# EAGLE design Balloon2 (EAGLE 7.3.0)
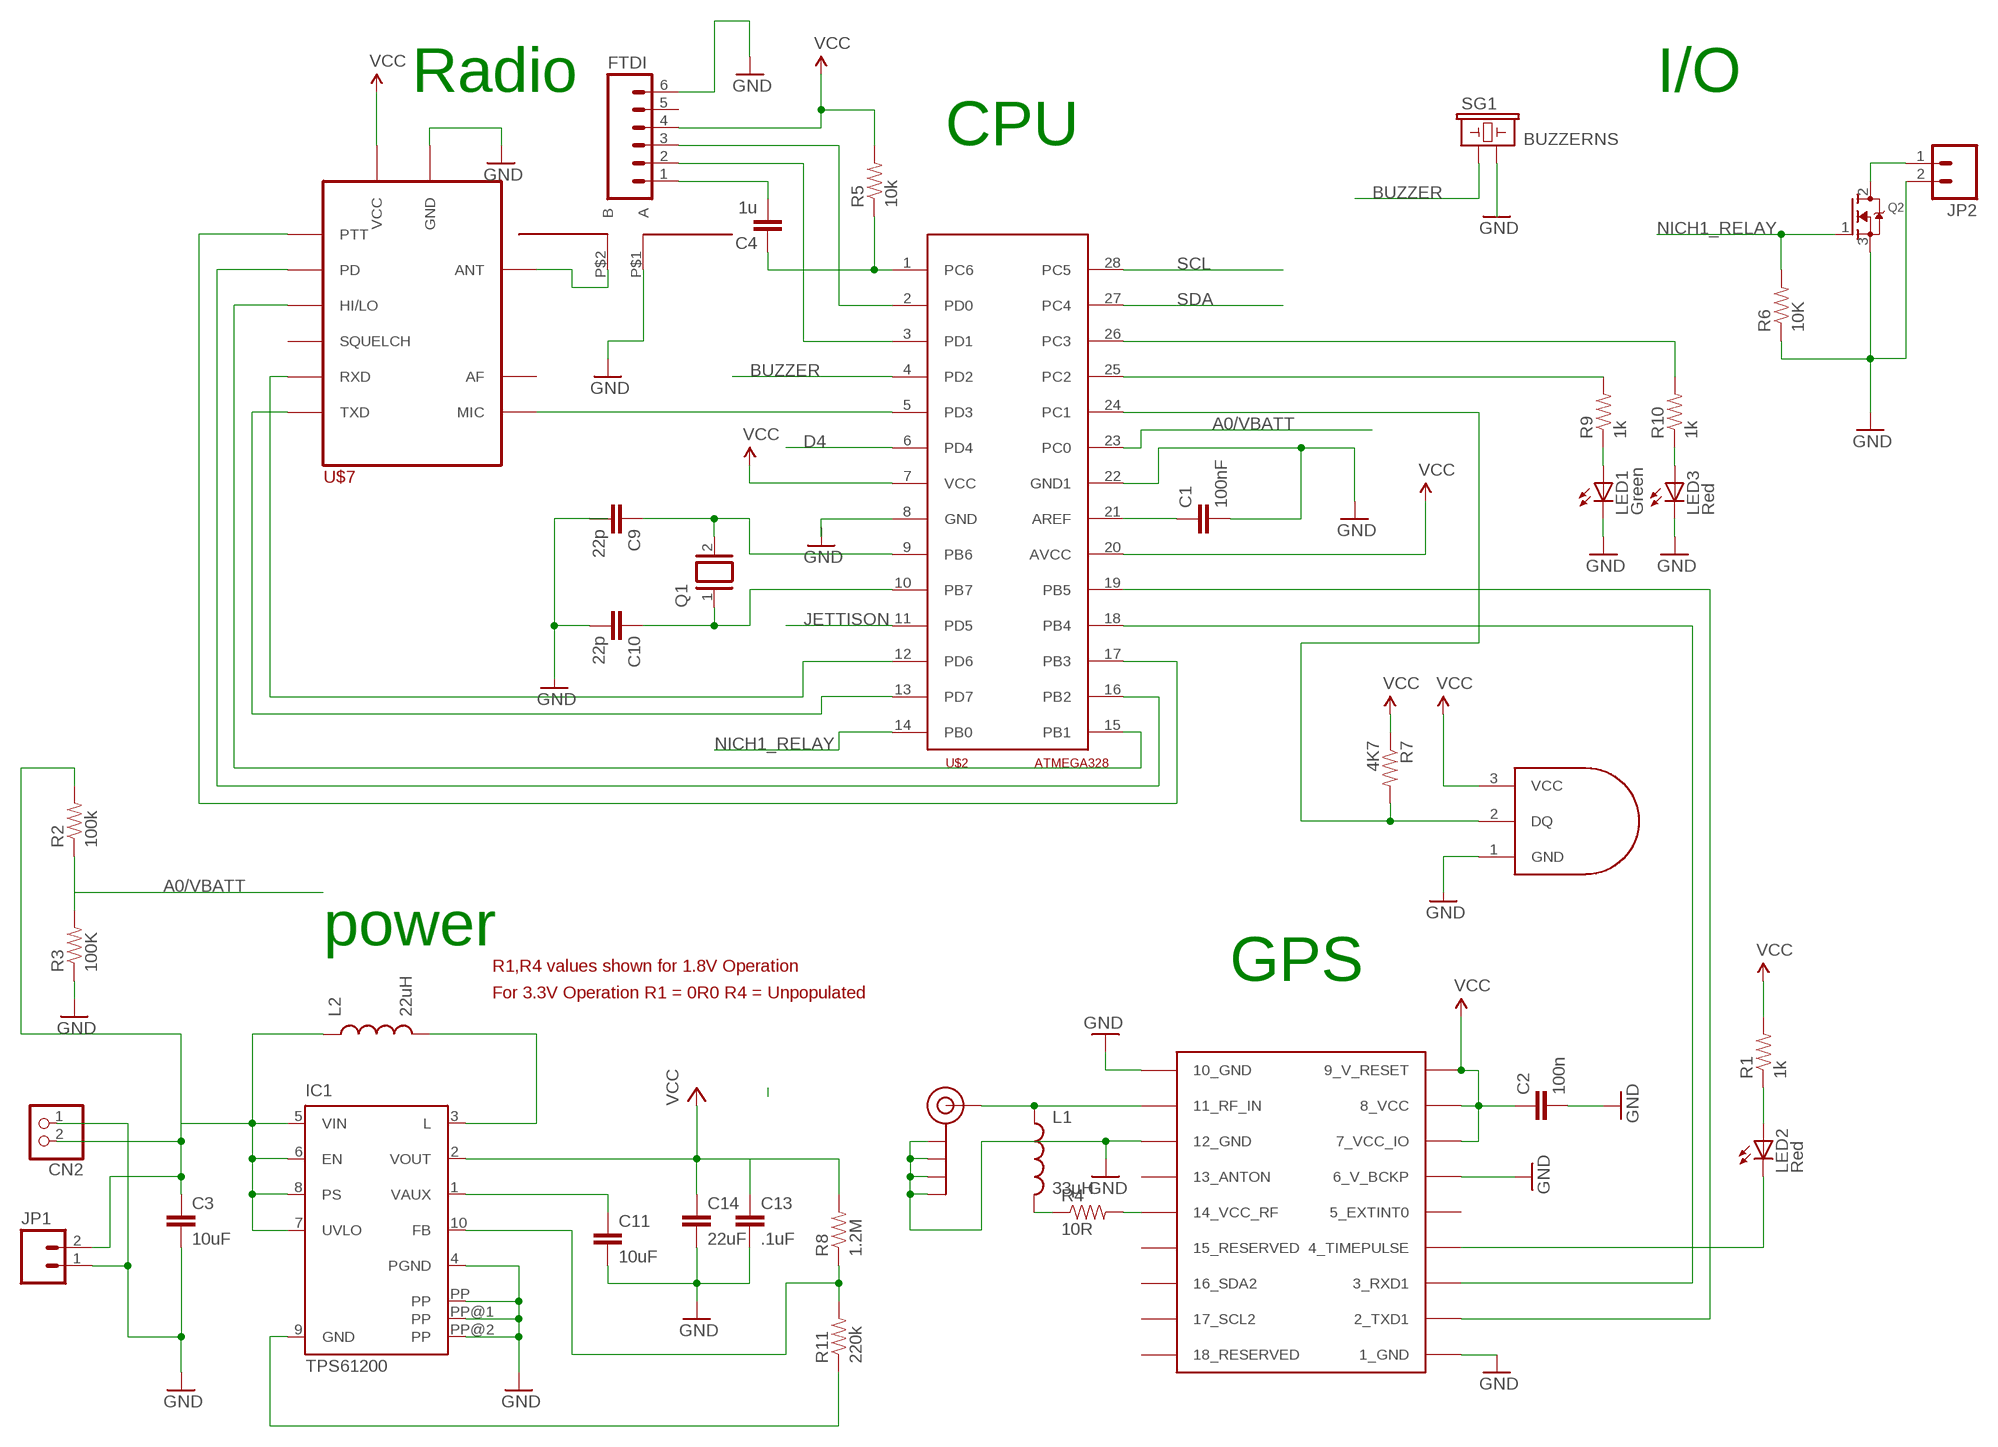
[diagram p0: schematic, sheet 1]

## Parts
C1  100nF  CAP0805  [0805]
C2  100n  CAP0805  [0805]
C3  10uF  CAP0805  [0805]
C4  1u  CAP0805  [0805]
C9  22p  CAP0805  [0805]
C10  22p  CAP0805  [0805]
C11  10uF  CAP0805  [0805]
C13  .1uF  CAP0805  [0805]
C14  22uF  CAP0805  [0805]
CN2  JST_2PIN-SMT-RA  [JST-PH-2-SMT-RA]
FTDI  M06SIP  [1X06]
IC1  TPS61200  [S-PDSO-N10]
J$2  SMA_EDGE  [SMA-EDGE]
JP1  M02PTH  [1X02]
JP2  M02PTH  [1X02]
L1  33µH  INDUCTOR0805  [0805]
L2  22uH  INDUCTOR  [INDUCTOR-SRP4020]
LED1  Green  LEDCHIP-LED0805  [CHIP-LED0805]
LED2  Red  LEDCHIP-LED0805  [CHIP-LED0805]
LED3  Red  LEDCHIP-LED0805  [CHIP-LED0805]
Q1  XTAL/S  [QS]
Q2  MOSFET-NGDS_TO220V  [TO220V]
R1  1k  RESISTOR0805-RES  [0805]
R2  100k  RESISTOR0805-RES  [0805]
R3  100K  RESISTOR0805-RES  [0805]
R4  10R  RESISTOR0805-RES  [0805]
R5  10k  RESISTOR0805-RES  [0805]
R6  10K  RESISTOR0805-RES  [0805]
R7  4K7  RESISTOR0805-RES  [0805]
R8  1.2M  RESISTOR0805-RES  [0805]
R9  1k  RESISTOR0805-RES  [0805]
R10  1k  RESISTOR0805-RES  [0805]
R11  220k  RESISTOR0805-RES  [0805]
SG1  BUZZERNS  [BUZZER-12MM-NS]
U$1  UBLOX_MAX  [UBLOX_MAX]
U$2  ATMEGA328  [DIL28]
U$3  DS18B20  [TO-92]
U$4  SOLDER-DIPOLE  [SOLDERED-DIPOLE-5MM]
U$7  DORJI  [DORJI]

## Nets
A0/VBATT [vcc]: R2.1 R3.2 U$2.23(PC0)
BUZZER: SG1.+ U$2.4(PD2)
D4: U$2.6(PD4)
GND [vcc]: C1.2 C2.2 C3.2 C11.2 C13.2 C14.2 CN2.1 FTDI.6 IC1.4(PGND) IC1.PP IC1.PP@1(PP) IC1.PP@2(PP) J$2.GND@0(GND) J$2.GND@1(GND) J$2.GND@2(GND) J$2.GND@3(GND) JP1.1 JP2.2 LED1.C LED3.C Q2.3(S) R3.1 R6.1 U$1.1_GND U$1.6_V_BCKP U$1.10_GND U$1.12_GND U$2.22(GND1) U$4.P$1(A) U$7.P$9(GND) U$7.P$10(GND)
JETTISON: U$2.11(PD5)
N$1: U$2.5(PD3) U$7.P$18(MIC)
N$2: C4.2 FTDI.1
N$3: C4.1 R5.1 U$2.1(PC6)
N$4: J$2.SIG(SIGNAL) L1.1 U$1.11_RF_IN
N$5: IC1.3(L) L2.P$2
N$6: U$4.P$2(B) U$7.P$12(ANT)
N$8: LED2.A R1.1
N$9: FTDI.3 U$2.2(PD0)
N$10: FTDI.2 U$2.3(PD1)
N$11: LED2.C U$1.4_TIMEPULSE
N$12: LED1.A R9.1
N$13: LED3.A R10.1
N$14: L1.2 R4.1
N$15: R4.2 U$1.14_VCC_RF
N$16: U$2.8(GND)
N$17: C9.1 Q1.2 U$2.9(PB6)
N$18: C10.1 Q1.1 U$2.10(PB7)
N$19: C10.2
N$20: U$1.3_RXD1 U$2.18(PB4)
N$21: U$2.12(PD6) U$7.P$16(RXD)
N$22: U$2.13(PD7) U$7.P$17(TXD)
N$23: U$2.15(PB1) U$7.P$7(HI/LO)
N$24: U$2.16(PB2) U$7.P$6(PD)
N$25: U$2.17(PB3) U$7.P$5(PTT)
N$26: C3.1 CN2.2 IC1.5(VIN) IC1.6(EN) IC1.7(UVLO) IC1.8(PS) JP1.2 L2.P$1 R2.2
N$27: U$3.1(GND)
N$28: C1.1 U$2.21(AREF)
N$29: U$1.2_TXD1 U$2.19(PB5)
N$30: R10.2 U$2.26(PC3)
N$31: R9.2 U$2.25(PC2)
N$32: R7.2 U$2.24(PC1) U$3.2(DQ)
N$33: SG1.-
N$34: JP2.1 Q2.2(D)
N$35: IC1.10(FB) R8.1 R11.2
N$36: C11.1 IC1.1(VAUX)
N$37: IC1.9(GND) R11.1
NICH1_RELAY: Q2.1(G) R6.2 U$2.14(PB0)
SCL: U$2.28(PC5)
SDA: U$2.27(PC4)
VCC: C2.1 C13.1 C14.1 FTDI.4 IC1.2(VOUT) R1.2 R5.2 R7.1 R8.2 U$1.7_VCC_IO U$1.8_VCC U$1.9_V_RESET U$2.7(VCC) U$2.20(AVCC) U$3.3(VCC) U$7.P$8(VCC)
Unconnected: C9.2 FTDI.5 U$1.5_EXTINT0 U$1.13_ANTON U$1.15_RESERVED U$1.16_SDA2 U$1.17_SCL2 U$1.18_RESERVED U$7.P$1(SQUELCH) U$7.P$3(AF)

## Notes on the sheet
- Radio | I/O
- CPU
- power
- R1,R4 values shown for 1.8V Operation
- GPS
- For 3.3V Operation R1 = 0R0 R4 = Unpopulated

## Library data of the parts
C1-C4 C9-C11 C13 C14 = SparkFun-Capacitors:CAP: Capacitor Standard 0603 ceramic capacitor, and 0.1" leaded capacitor.
CN2 = adafruit:JST_2PIN: JST 2-Pin Connectors of various flavors SMT-RA (S2B-PH-SM4) 4UConnector #17311 SMT (B2B-PH-SM4) THM-RA (S2B-PH) THM (B2B-PH)
FTDI = SparkFun:M06: Header 6 Standard 6-pin 0.1" header. Use with straight break away headers (SKU : PRT-00116), right angle break away headers (PRT-00553), swiss pins (PRT-00743), machine pins (PRT-00117), and female headers (PRT-00115). Molex polarized connector foot print use with SKU : PRT-08094 with associated crimp pins and housings. NOTES ON THE VARIANTS LOCK and LOCK_LONGPADS... This footprint was designed to help hold the alignment of a through-hole component (i.e. 6-pin header) while soldering it into place. You may notice that each hole has been shifted either up or down by 0.005 of an inch from it's more standard position (which is a perfectly straight line). This slight alteration caused the pins (the squares in the middle) to touch the edges of the holes. Because they are alternating, it causes a "brace" to hold the component in place. 0.005 has proven to be the perfect amount of "off-center" position when using our standard breakaway headers. Although looks a little odd when you look at the bare footprint, once you have a header in there, the alteration is very hard to notice. Also, if you push a header all the way into place, it is covered up entirely on the bottom side. This idea of altering the position of holes to aid alignment will be further integrated into the Sparkfun Library for other footprints. It can help hold any component with 3 or more connection pins.
IC1 = texas:TPS6120*: LOW INPUT VOLTAGE SYNCHRONOUS BOOST CONVERTER WITH 1.3-A SWITCHES Source: http://focus.ti.com/lit/ds/symlink/tps61200.pdf; MPN: TPS61200DRCT; OC_FARNELL: 1471238; OC_NEWARK: 37M0066
J$2 = SparkFun:SMA_EDGE: SMA Antenna Connector End launch SMA connector. The paste layer has been removed so that the connector can be hand soldered onto the board after reflow.
JP1 JP2 = SparkFun-Connectors:M02: Standard 2-pin 0.1" header. Use with - straight break away headers ( PRT-00116) - right angle break away headers (PRT-00553) - swiss pins (PRT-00743) - machine pins (PRT-00117) - female headers (PRT-00115) Molex polarized connector foot print use with: PRT-08233 with associated crimp pins and housings. 2.54_SCREWTERM for use with PRT-10571. 3.5mm Screw Terminal footprints for PRT-08084 5mm Screw Terminal footprints for use with PRT-08432
L1 L2 = SparkFun-Passives:INDUCTOR: Inductors Basic Inductor/Choke - 0603 and 1206. Footprints are not proven and vary greatly between part numbers. INDUCTOR POWER 3.3UH 4.0A SMD 0.197" L x 0.197" W x 0.177" H (5.00mm x 5.00mm x 4.50mm)
LED1-LED3 = adafruit:LED: LED OSRAM: - CHIPLED LG R971, LG N971, LY N971, LG Q971, LY Q971, LO R971, LY R971 LH N974, LH R974 LS Q976, LO Q976, LY Q976 LO Q996 - Hyper CHIPLED LW Q18S LB Q993, LB Q99A, LB R99A - SideLED LS A670, LO A670, LY A670, LG A670, LP A670 LB A673, LV A673, LT A673, LW A673 LH A674 LY A675 LS A676, LA A676, LO A676, LY A676, LW A676 LS A679, LY A679, LG A679 - Hyper Micro SIDELED® LS Y876, LA Y876, LO Y876, LY Y876 LT Y87S - SmartLED LW L88C, LW L88S LB L89C, LB L89S, LG L890 LS L89K, LO L89K, LY L89K LS L896, LA L896, LO L896, LY L896 - TOPLED LS T670, LO T670, LY T670, LG T670, LP T670 LSG T670, LSP T670, LSY T670, LOP T670, LYG T670 LG T671, LOG T671, LSG T671 LB T673, LV T673, LT T673, LW T673 LH T674 LS T676, LA T676, LO T676, LY T676, LB T676, LH T676, LSB T676, LW T676 LB T67C, LV T67C, LT T67C, LS T67K, LO T67K, LY T67K, LW E67C LS E67B, LA E67B, LO E67B, LY E67B, LB E67C, LV E67C, LT E67C LW T67C LS T679, LY T679, LG T679 LS T770, LO T770, LY T770, LG T770, LP T770 LB T773, LV T773, LT T773, LW T773 LH T774 LS E675, LA E675, LY E675, LS T675 LS T776, LA T776, LO T776, LY T776, LB T776 LHGB T686 LT T68C, LB T68C - Hyper Mini TOPLED® LB M676 - Mini TOPLED Santana® LG M470 LS M47K, LO M47K, LY M47K Source: http://www.osram.convergy.de/
Q1 = special:XTAL/S: CRYSTAL
Q2 = adafruit:MOSFET-N: N-Channel Mosfet 2N7002E - 60V 260mA SOT23 [Digikey: 2N7002ET1GOSTR-ND] - REEL BSH103 - 30V 850mA SOT23 [Digikey: 568-5013-1-ND]
R1-R11 = SparkFun-Passives:RESISTOR: Resistor Basic schematic elements and footprints for 0603, 1206, and PTH resistors.
SG1 = SparkFun-Electromechanical:BUZZER: Buzzer 12mm Spark Fun Electronics SKU : Comp-Buzzer
U$1 = ava:UBLOX_MAX: UBLOX MAX
U$2 = ido:ATMEGA328
U$3 = ido:DS18B20
U$4 = ido:SOLDER-DIPOLE
U$7 = dorji:DORJI: DRA818V 2-Meter transceiver modul

## Net classes
0 default: width 0.203 mm
1 vcc: width 0.254 mm
2 gnd: width 0.305 mm, drill 0.508 mm, clearance 0.152 mm

## Board
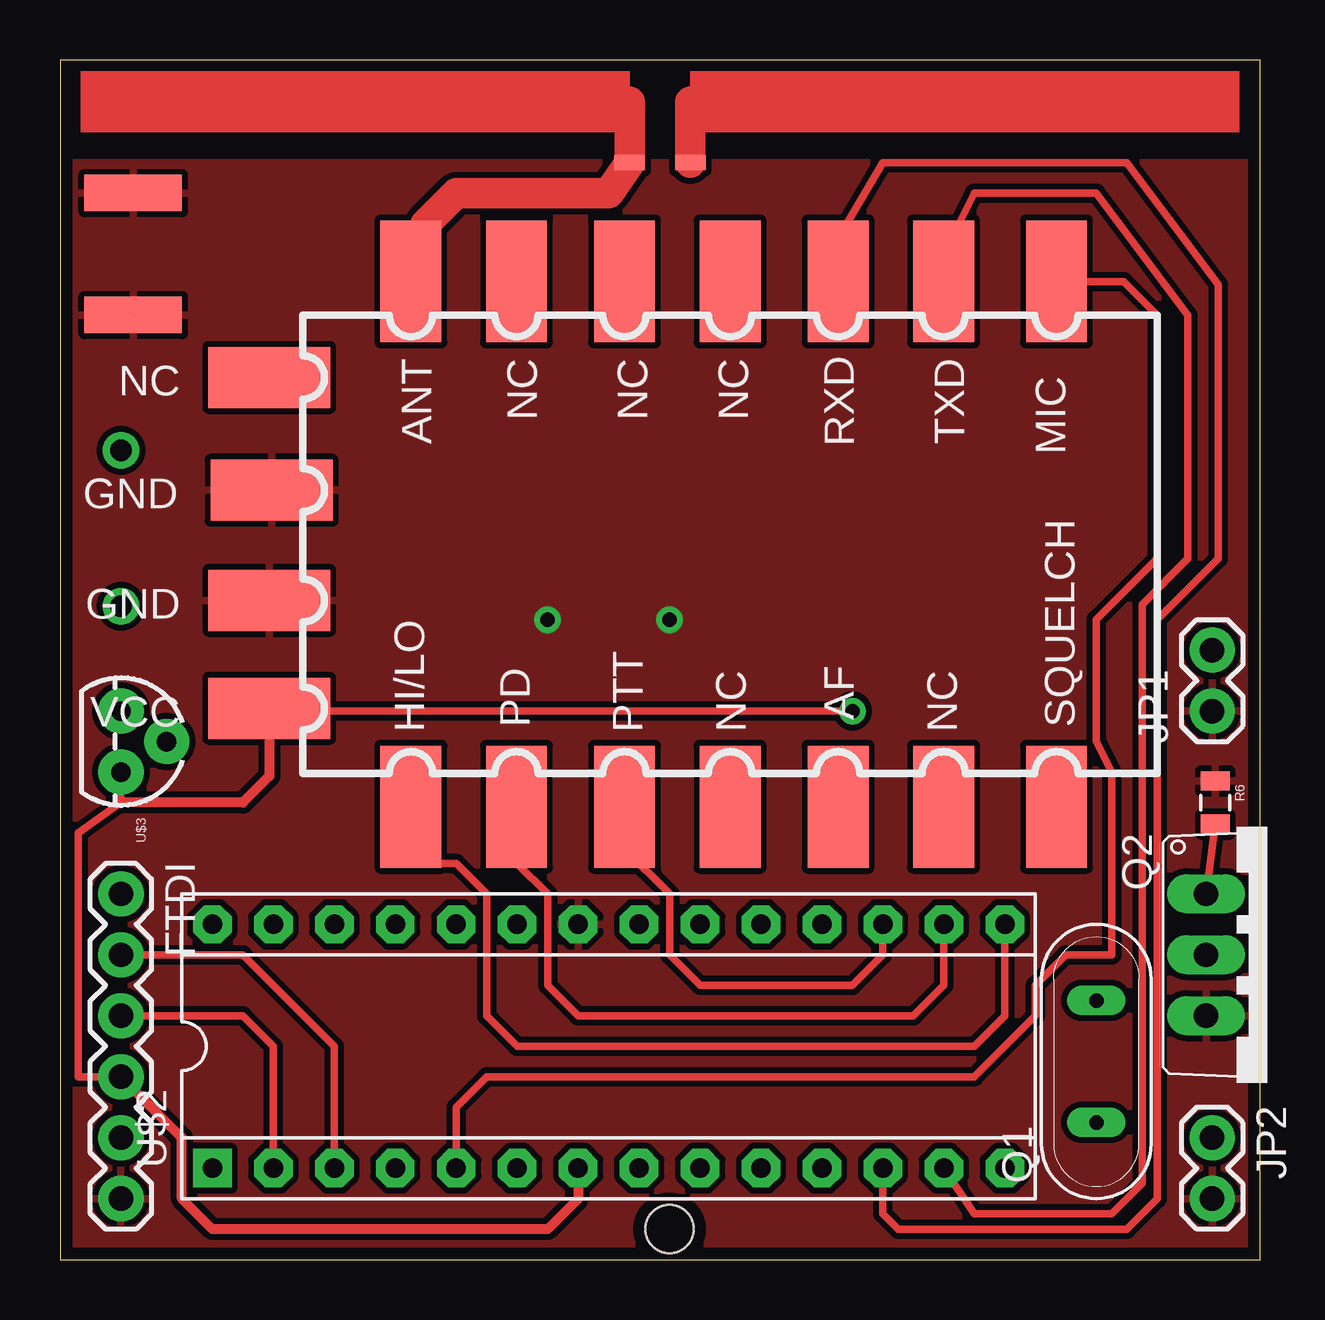
[diagram p1: board, top side]
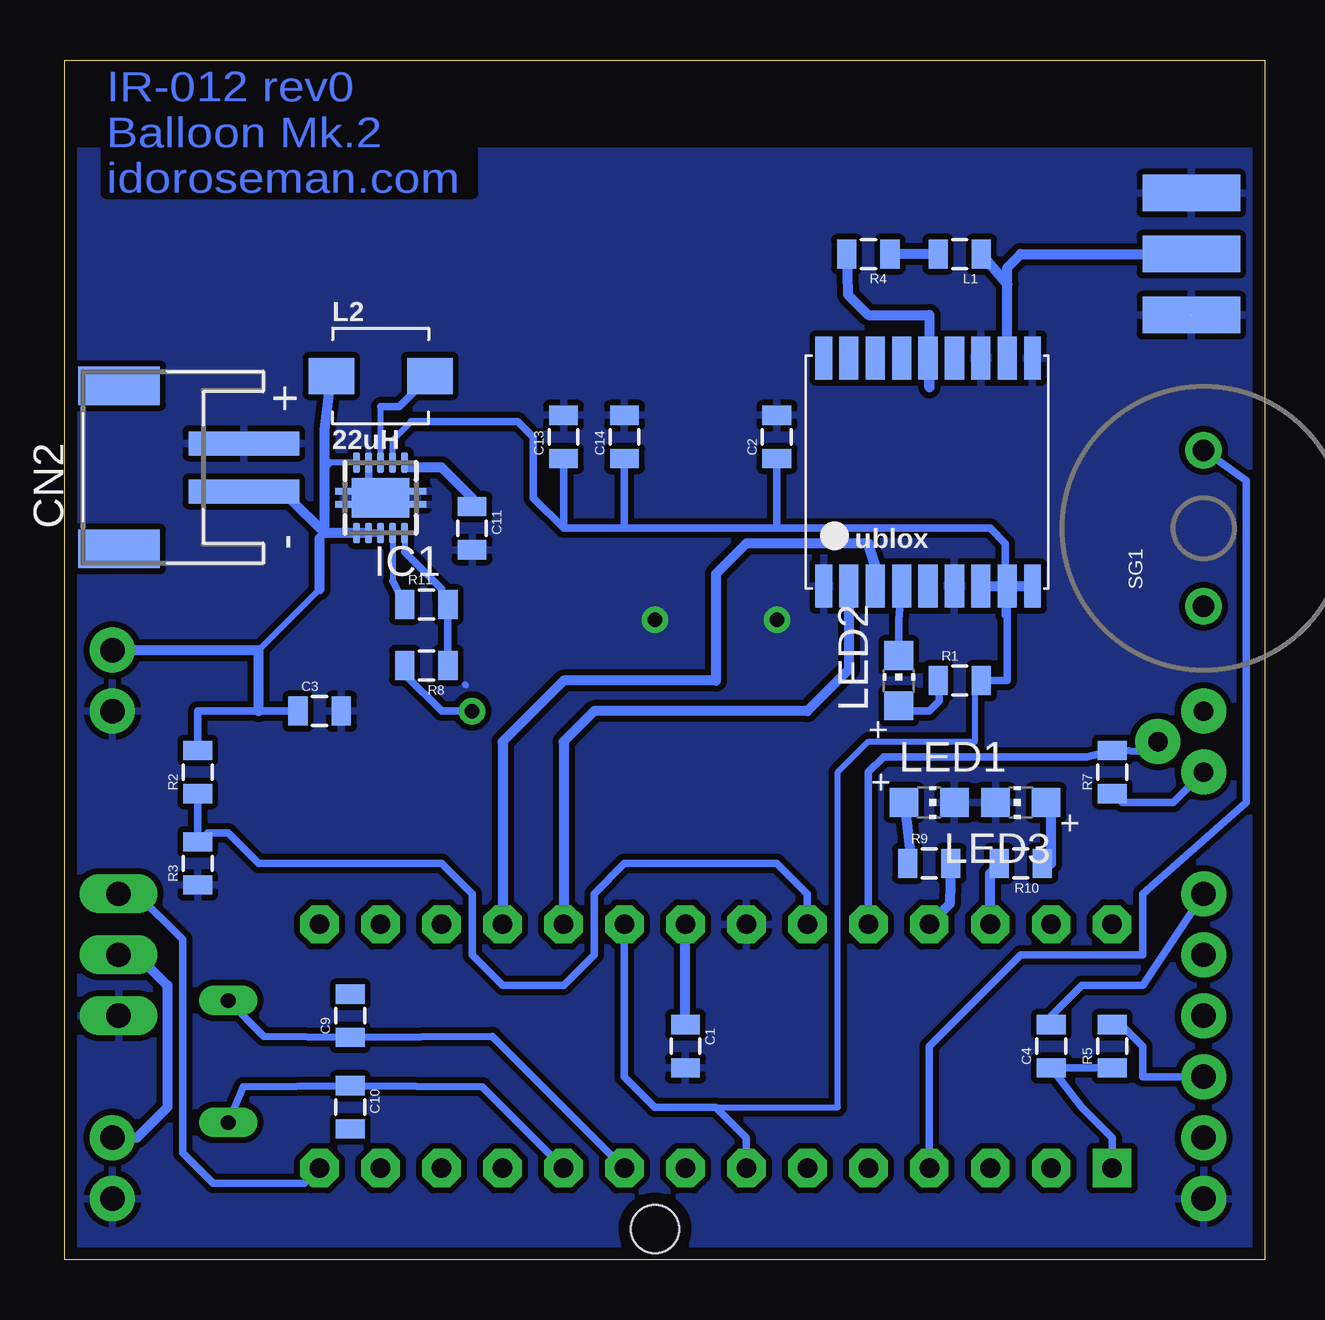
[diagram p2: board, bottom side, seen from below]

Size 50 x 50 mm. Coordinates in mm from the lower left corner, seen from the top.
Outline: 0,0 50,0 50,50 0,50 0,0
Copper layers (1*16): Top 0.035mm / dielectric 1.5mm / Bottom 0.035mm
Design rules "4project": minimum track width 8mil, minimum drill 0.3mm, track to track 8mil, track to pad 8mil, pad to pad 8mil, via to via 8mil, smd to smd 8mil, copper to edge 20mil, drill to drill 8mil, minimum pad ring 12mil, minimum via ring 10mil, stop-mask expansion 4mil, vias tented up to drill 25mil, thermal gap 10mil
Holes 2 mm at 25.4,1.27

### Footprints (pad centres in the part's own frame; a part is rotated, then mirrored left to right if it is on the bottom)
0805 = smd 0.8 x 1.2: 1 -0.9,0; 2 0.9,0
JST-PH-2-SMT-RA = smd 1 x 4.6: 1 1,-3.7; 2 -1,-3.7 | smd 1.6 x 3.4: NC1 -3.4,1.5; NC2 3.4,1.5
1X06 = drill 1.016 pad 1.88: 1 0,0; 2 2.54,0; 3 5.08,0; 4 7.62,0; 5 10.16,0; 6 12.7,0
S-PDSO-N10 = smd 0.28 x 0.85: 1 -1,-1.475; 2 -0.5,-1.475; 3 0,-1.475; 4 0.5,-1.475; 5 1,-1.475; 6 1,1.475; 7 0.5,1.475; 8 0,1.475; 9 -0.5,1.475; 10 -1,1.475 | smd 2.4 x 1.65: PP 0,0 | smd 3.8 x 0.28: PP@1 0,0.275; PP@2 0,-0.275
SMA-EDGE = smd 1.524 x 4.064: GND@0 -2.54,0; GND@1 2.54,0; SIG 0,0 | smd 1.524 x 4.064 bottom: GND@2 -2.54,0; GND@3 2.54,0
1X02 = drill 1.016 pad 1.88: 1 0,0; 2 2.54,0
INDUCTOR-SRP4020 = smd 1.9 x 1.5: P$1 -2.05,0; P$2 2.05,0
CHIP-LED0805 = smd 1.2 x 1.2: A 0,-1.05; C 0,1.05
QS = drill 0.61 long: 1 -2.54,0; 2 2.54,0
TO220V = drill 1.016 long: 1 -2.54,-2.54; 2 0,-2.54; 3 2.54,-2.54
BUZZER-12MM-NS = drill 0.9: + 3.25,0; - -3.25,0
UBLOX_MAX = smd 1.8 x 0.7: 1_GND 4.95,-4.4; 9_V_RESET 4.95,4.3; 10_GND -4.55,4.3; 18_RESERVED -4.55,-4.4 | smd 1.8 x 0.8: 2_TXD1 4.95,-3.35; 3_RXD1 4.95,-2.25; 4_TIMEPULSE 4.95,-1.15; 5_EXTINT0 4.95,-0.05; 6_V_BCKP 4.95,1.05; 7_VCC_IO 4.95,2.15; 8_VCC 4.95,3.25; 11_RF_IN -4.55,3.25; 12_GND -4.55,2.15; 13_ANTON -4.55,1.05; 14_VCC_RF -4.55,-0.05; 15_RESERVED -4.55,-1.15; 16_SDA2 -4.55,-2.25; 17_SCL2 -4.55,-3.35
DIL28 = drill 0.813 pad 1.6 square: 1 -16.51,-5.08 | drill 0.813 pad 1.6 octagon: 2 -13.97,-5.08; 3 -11.43,-5.08; 4 -8.89,-5.08; 5 -6.35,-5.08; 6 -3.81,-5.08; 7 -1.27,-5.08; 8 1.27,-5.08; 9 3.81,-5.08; 10 6.35,-5.08; 11 8.89,-5.08; 12 11.43,-5.08; 13 13.97,-5.08; 14 16.51,-5.08; 15 16.51,5.08; 16 13.97,5.08; 17 11.43,5.08; 18 8.89,5.08; 19 6.35,5.08; 20 3.81,5.08; 21 1.27,5.08; 22 -1.27,5.08; 23 -3.81,5.08; 24 -6.35,5.08; 25 -8.89,5.08; 26 -11.43,5.08; 27 -13.97,5.08; 28 -16.51,5.08
TO-92 = drill 0.813 pad 1.88: 1 -1.27,1.27; 2 0,3.175; 3 1.27,1.27
SOLDERED-DIPOLE-5MM = smd 1.27 x 0.635: P$1 -1.27,2.54; P$2 1.27,2.54
DORJI = smd 2.54 x 5.08: P$1 4.2,20.5; P$2 8.9,20.5; P$3 13.3,20.5; P$4 17.8,20.5; P$5 22.2,20.5; P$6 26.7,20.5; P$7 31.1,20.5; P$12 31.1,-1.4; P$13 26.7,-1.4; P$14 22.2,-1.4; P$15 17.8,-1.4; P$16 13.3,-1.4; P$17 8.9,-1.4; P$18 4.2,-1.4 | smd 5.08 x 2.54: P$8 37,16.4; P$9 37,11.9; P$10 36.9,7.3; P$11 37,2.6

### Placement (x,y rotation side)
C1  24.13,8.89 270 bottom
C2  20.32,34.29 90 bottom
C3  39.37,22.86 0 bottom
C4  8.89,8.89 90 bottom
C9  38.1,10.16 90 bottom
C10  38.1,6.35 270 bottom
C11  33.02,30.48 270 bottom
C13  29.21,34.29 90 bottom
C14  26.67,34.29 90 bottom
CN2  46.23,33.02 90 bottom
FTDI  2.54,15.24 270 top
IC1  36.83,31.75 180 bottom
J$2  3.05,41.91 90 bottom
JP1  48.01,22.86 90 top
JP2  48.01,5.08 270 top
L1  12.7,41.91 180 bottom
L2  36.83,36.83 0 bottom
LED1  13.97,19.05 270 bottom
LED2  15.24,24.13 0 bottom
LED3  10.16,19.05 90 bottom
Q1  43.18,8.26 90 top
Q2  50.29,12.7 270 top
R1  12.7,24.13 0 bottom
R2  44.45,20.32 90 bottom
R3  44.45,16.51 90 bottom
R4  16.51,41.91 180 bottom
R5  6.35,8.89 90 bottom
R6  48.13,19.05 270 top
R7  6.35,20.32 90 bottom
R8  34.92,24.77 180 bottom
R9  13.97,16.51 0 bottom
R10  10.16,16.51 180 bottom
R11  34.92,27.3 0 bottom
SG1  2.54,30.48 90 bottom
U$1  13.97,33.02 270 bottom
U$2  22.86,8.89 0 top
U$3  1.27,21.59 270 top
U$4  25,48.26 180 top
U$7  45.72,39.37 180 top

### Tracks (layer width: path | path; a pad name or v marks a point on that pad's centre or on a via)
A0/VBATT
  Bottom 0.305: R2.1 R3.2 44.03,17.78 43.18,17.78 41.91,16.51 34.29,16.51 33.02,15.24 33.02,12.7 31.75,11.43 29.21,11.43 27.94,12.7 27.94,15.24 26.67,16.51 20.32,16.51 19.05,15.24 U$2.23
BUZZER
  Bottom 0.305: U$2.4 13.97,8.89 10.16,12.7 5.08,12.7 5.08,15.24 0.76,19.05 0.76,32.46 SG1.+
GND  (via drill 0.6)  (1 unrouted)
  Bottom 0.254: 33.33,23.98 33.28,23.93
  Bottom 0.305: IC1.4 37.33,32.52 IC1.PP@2
  other vias: 20.32,26.67 25.4,26.67
  pour Top (isolate 0.254): 0,0 0,45.72 50,45.72 50,0
  pour Bottom (isolate 0.254): 0,0 0,46.19 50,46.19 50,0
N$1
  Top 0.305: U$7.P$18 44.32,40.77 45.72,39.37 45.72,29.21 43.18,26.67 43.18,21.59 43.81,20.32 43.81,12.7 41.91,12.7 40.64,11.43 40.64,10.16 38.1,7.62 17.78,7.62 16.51,6.35 U$2.5
N$2
  Bottom 0.305: FTDI.1 5.08,11.43 7.62,11.43 8.89,10.16 C4.2
N$3
  Bottom 0.305: R5.1 C4.1 7.62,6.35 6.35,5.08 U$2.1
N$4
  Bottom 0.406: U$1.11_RF_IN 10.72,40.64 | 10.72,40.64 10.72,41.35 10.16,41.91 J$2.SIG | L1.1 10.72,40.64
N$5
  Bottom 0.254: IC1.3 36.83,35.56
  Bottom 0.305: 36.83,35.56 36.05,35.56 L2.P$2
N$6
  Top 1.27: U$4.P$2 22.86,44.45 16.51,44.45 15.24,43.18 15.24,40.12 U$7.P$12
N$8
  Bottom 0.305: R1.1 13.55,23.28 13.97,22.86 14.72,22.86 LED2.A
N$9
  Top 0.305: U$2.2 8.89,8.89 7.62,10.16 FTDI.3
N$10
  Top 0.305: FTDI.2 7.62,12.7 11.43,8.89 U$2.3
N$11
  Bottom 0.305: LED2.C 15.24,26.68 U$1.4_TIMEPULSE
N$12
  Bottom 0.406: LED1.A 14.72,16.61 R9.1
N$13
  Bottom 0.406: R10.1 8.89,16.51 8.89,18.53 LED3.A
N$14
  Bottom 0.406: L1.2 R4.1
N$15
  Bottom 0.406: R4.2 17.36,40.22 16.51,39.37 13.97,39.37 13.97,36.35 U$1.14_VCC_RF
N$17
  Bottom 0.305: U$2.9 32.17,9.31 C9.1 41.7,9.31 Q1.2
N$18
  Bottom 0.305: Q1.1 42.55,7.2 C10.1 32.6,7.2 U$2.10
N$20
  Bottom 0.406: U$1.3_RXD1 16.22,28.92 16.51,29.84 21.59,29.84 22.86,28.57 22.86,24.13 29.21,24.13 31.75,21.59 U$2.18
N$21
  Top 0.305: U$7.P$16 32.42,42.58 34.29,45.72 44.45,45.72 48.26,40.64 48.26,29.21 45.72,26.67 45.72,2.54 44.45,1.27 34.92,1.27 34.29,1.91 U$2.12
N$22
  Top 0.305: U$2.13 38.1,1.91 43.81,1.91 45.09,3.17 45.09,27.3 46.99,29.21 46.99,39.37 43.18,44.45 38.1,44.45 36.83,41.91 36.83,39.51 U$7.P$17
N$23
  Top 0.305: U$2.15 39.37,10.16 38.1,8.89 19.05,8.89 17.78,10.16 17.78,15.24 16.51,16.51 15.24,16.51 15.24,18.25 U$7.P$7
N$24
  Top 0.305: U$7.P$6 19.02,16.54 20.32,15.24 20.32,11.43 21.59,10.16 35.56,10.16 36.83,11.43 U$2.16
N$25
  Top 0.305: U$7.P$5 23.52,17.12 25.4,15.24 25.4,12.7 26.67,11.43 33.02,11.43 34.29,12.7 U$2.17
N$26
  Bottom 0.254: 43.06,32.25 CN2.2 | IC1.5 38.96,33.23 | 41.91,25.4 39.37,27.94 | IC1.7 37.38,30.29 37.38,30.27 | IC1.6 37.83,30.29 IC1.6
  Bottom 0.305: IC1.8 IC1.7 | 38.96,33.23 39.16,33.02 | R2.2 44.45,22.86 41.91,22.86 C3.1 | 39.37,30.07 39.16,30.27
  Bottom 0.406: IC1.7 37.38,30.27 IC1.6 39.16,30.27 | 39.16,30.27 40.64,31.75 43.02,31.75 CN2.2 | 39.16,30.27 39.16,33.02 39.16,34.58 L2.P$1 | 41.91,22.86 41.91,25.4 JP1.2 | 39.37,27.94 39.37,30.07
N$28
  Bottom 0.406: C1.1 U$2.21
N$29
  Bottom 0.406: U$1.2_TXD1 17.32,24.59 19.05,22.86 27.94,22.86 29.21,21.59 U$2.19
N$30
  Bottom 0.406: U$2.26 11.43,16.09 R10.2
N$31
  Bottom 0.406: R9.2 13.12,14.82 U$2.25
N$32
  Bottom 0.305: U$3.2 4.87,21.17 R7.2 7.41,20.95 15.88,20.95 16.51,20.32 U$2.24
N$34
  Bottom 0.406: Q2.2 46.99,12.7 45.72,11.43 45.72,6.35 46.99,5.08 JP2.1
N$35
  Bottom 0.254: IC1.10 35.83,29.48
  Bottom 0.305: R8.1 R11.2 34.29,27.52 34.29,27.94 35.83,29.48
N$36
  Bottom 0.254: 35.62,33.02 IC1.1
  Bottom 0.406: C11.1 33.02,31.75 34.29,33.02 35.62,33.02
N$37
  Bottom 0.254: IC1.9 36.33,28.29
  Bottom 0.305: 36.33,28.29 R11.1
NICH1_RELAY
  Top 0.305: R6.2 Q2.1
  Bottom 0.305: Q2.1 46.99,15.24 45.09,13.34 45.09,4.45 43.81,3.17 40.01,3.17 U$2.14
VCC  (via drill 0.6)
  Top 0.254: 26.75,14.06 U$2.20
  Top 0.305: U$3.3 2.54,19.05 0.76,17.78 0.76,7.62 FTDI.4 | v33.02,22.86 8.83,22.86 U$7.P$8
  Top 0.406: U$7.P$8 8.72,20.15 7.62,19.05 2.54,19.05 | U$2.7 21.59,2.54 20.32,1.27 6.35,1.27 5.08,2.54 5.08,5.08 FTDI.4
  Bottom 0.254: 22.86,6.35 17.78,6.35 17.78,20.32 16.51,21.59 12.06,21.59 12.06,24.13 R1.2 | IC1.2 36.33,34.16 35.56,34.92
  Bottom 0.305: R5.2 5.93,9.74 5.08,8.89 5.08,7.62 FTDI.4 | U$3.3 3.81,19.05 5.93,19.05 R7.1 | U$2.20 26.67,7.62 25.4,6.35 22.86,6.35 21.59,5.08 U$2.7 | R1.2 10.72,24.13 U$1.8_VCC 10.79,26.88 10.79,29.84 11.43,30.48 20.32,30.48 | 35.56,34.92 31.11,34.92 30.48,34.29 30.48,31.75 29.21,30.48 | 29.21,30.48 26.67,30.48 | 26.67,30.48 20.32,30.48 | C2.1 20.32,30.48 | C14.1 26.67,30.48 | C13.1 29.21,30.48 | R8.2 35.77,24.34 34.29,22.86 v33.02,22.86
  Bottom 0.406: U$1.7_VCC_IO U$1.8_VCC U$1.9_V_RESET

### Text on the board
Bottom: IR-012 rev0 / Balloon Mk.2 / idoroseman.com